# EAGLE schematic MURI_MEGA_DATALOGGER (EAGLE 9.1.1)
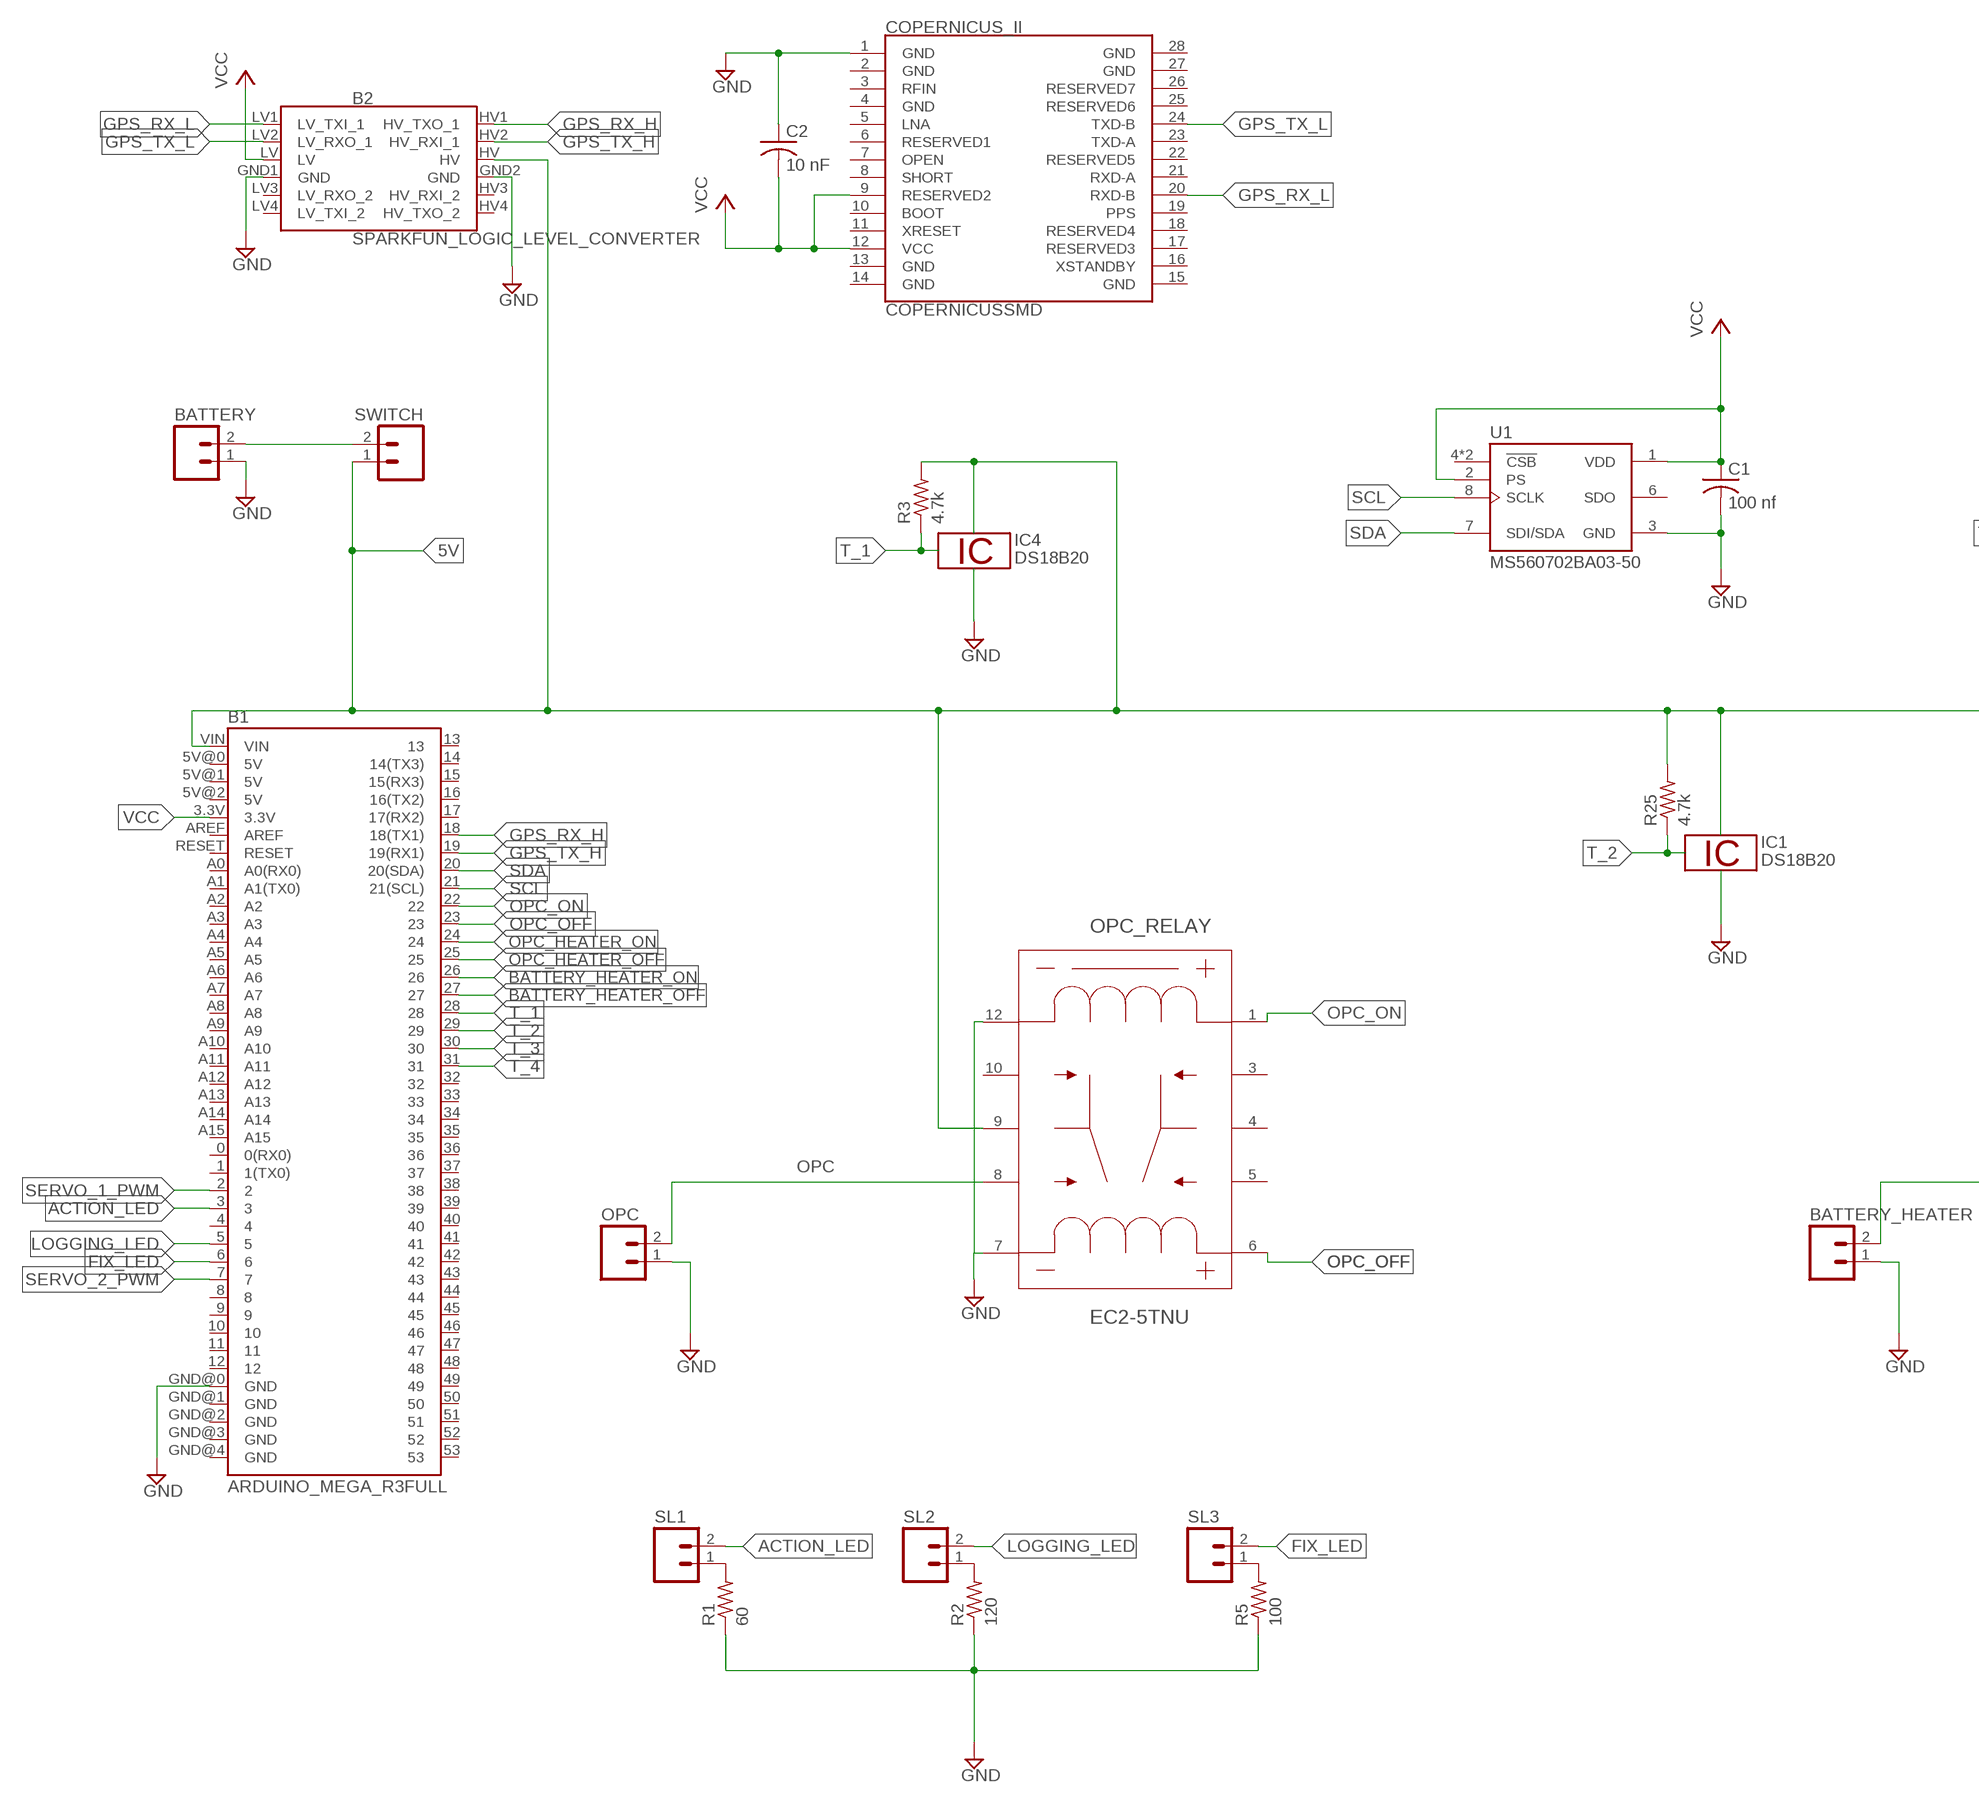
[diagram p0: schematic, sheet 1, part 1 of 2]
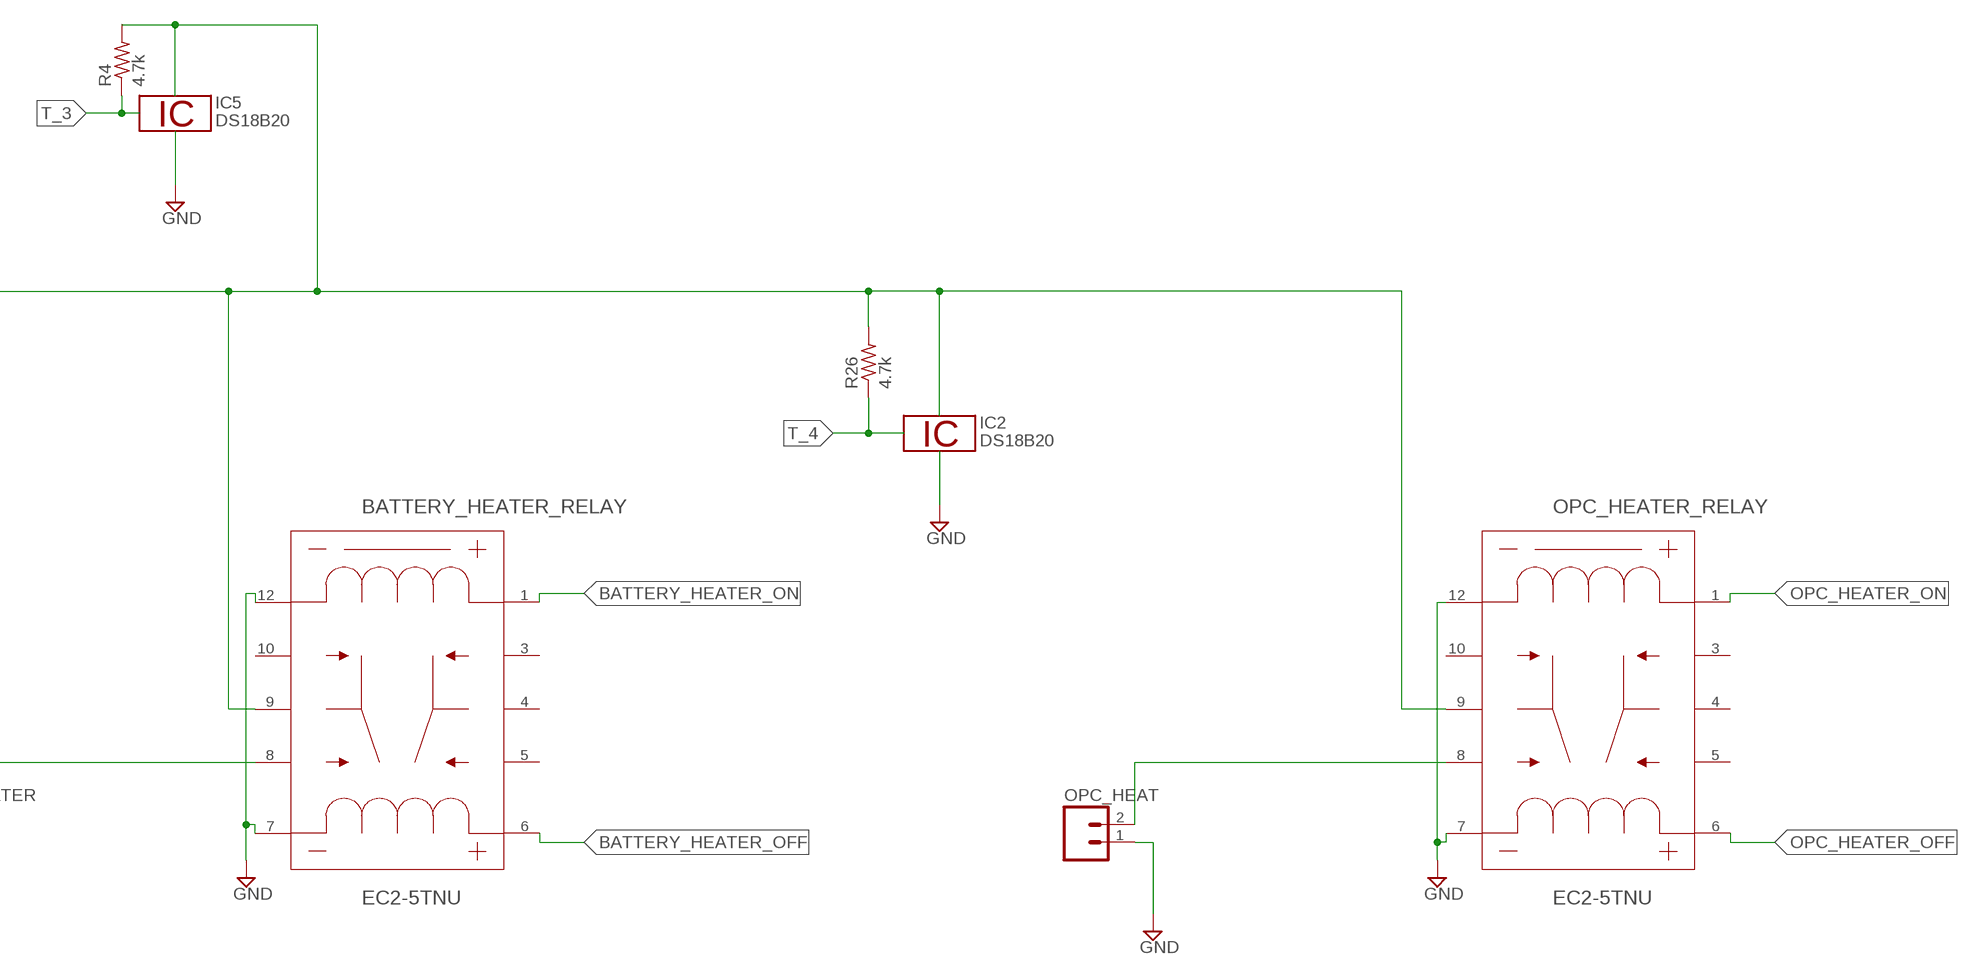
[diagram p1: schematic, sheet 1, part 2 of 2]

## Parts
B1  ARDUINO_MEGA_R3FULL  [ARDUINO_MEGA]
B2  SPARKFUN_LOGIC_LEVEL_CONVERTER  [SPARKFUN_LOGIC_LEVEL_CONVERTER]
BATTERY  M02  [02P]
BATTERY_HEATER  M02  [02P]
BATTERY_HEATER_RELAY  EC2-5TNU  [EC2TNU]
C1  100 nf  C-US025-025X050  [C025-025X050]
C2  10 nF  C-US025-025X050  [C025-025X050]
COPERNICUS_II  COPERNICUSSMD  [COPERNICUS]
IC1  DS18B20  [TO92-]
IC2  DS18B20  [TO92-]
IC4  DS18B20  [TO92-]
IC5  DS18B20  [TO92-]
OPC  M02  [02P]
OPC_HEAT  M02  [02P]
OPC_HEATER_RELAY  EC2-5TNU  [EC2TNU]
OPC_RELAY  EC2-5TNU  [EC2TNU]
R1  60  R-US_0204/7  [0204/7]
R2  120  R-US_0204/7  [0204/7]
R3  4.7k  R-US_0204/7  [0204/7]
R4  4.7k  R-US_0204/7  [0204/7]
R5  100  R-US_0204/7  [0204/7]
R25  4.7k  R-US_0204/7  [0204/7]
R26  4.7k  R-US_0204/7  [0204/7]
SL1  M02  [02P]
SL2  M02  [02P]
SL3  M02  [02P]
SWITCH  M02  [02P]
U1  MS560702BA03-50  [SON125P300X500X100-8N]

## Nets
5V [5V_Relay]: B1.VIN B2.HV BATTERY_HEATER_RELAY.9 OPC_HEATER_RELAY.9 OPC_RELAY.9 R3.2 R4.2 R25.2 R26.2 SWITCH.1
ACTION_LED: B1.3 SL1.2
BATTERY_HEATER [5V_Relay]: OPC_HEAT.2 OPC_HEATER_RELAY.8
BATTERY_HEATER_OFF: B1.27 BATTERY_HEATER_RELAY.6
BATTERY_HEATER_ON: B1.26 BATTERY_HEATER_RELAY.1
FIX_LED: B1.6 SL3.2
GND [5V_Relay]: B1.GND@0(GND) B2.GND1(GND) B2.GND2(GND) BATTERY.1 BATTERY_HEATER.1 BATTERY_HEATER_RELAY.7 BATTERY_HEATER_RELAY.12 C1.2 C2.1 COPERNICUS_II.1(GND) OPC.1 OPC_HEAT.1 OPC_HEATER_RELAY.7 OPC_HEATER_RELAY.12 OPC_RELAY.7 OPC_RELAY.12 R1.1 R2.1 R5.1 U1.3(GND)
GPS_RX_H: B1.18(18(TX1)) B2.HV1(HV_TXO_1)
GPS_RX_L: B2.LV1(LV_TXI_1) COPERNICUS_II.20(RXD-B)
GPS_TX_H: B1.19(19(RX1)) B2.HV2(HV_RXI_1)
GPS_TX_L: B2.LV2(LV_RXO_1) COPERNICUS_II.24(TXD-B)
LOGGING_LED: B1.5 SL2.2
N$1: BATTERY.2 SWITCH.2
N$2 [5V_Relay]: R5.2 SL3.1
N$3 [5V_Relay]: R1.2 SL1.1
N$4: R2.2 SL2.1
OPC [5V_Relay]: BATTERY_HEATER.2 BATTERY_HEATER_RELAY.8 OPC.2 OPC_RELAY.8
OPC_HEATER_OFF: B1.25 OPC_HEATER_RELAY.6
OPC_HEATER_ON: B1.24 OPC_HEATER_RELAY.1
OPC_OFF: B1.23 OPC_RELAY.6
OPC_ON: B1.22 OPC_RELAY.1
SCL: B1.21(21(SCL)) U1.8(SCLK)
SDA: B1.20(20(SDA)) U1.7(SDI/SDA)
SERVO_1_PWM: B1.2
SERVO_2_PWM: B1.7
T_1: B1.28 R3.1
T_2: B1.29 R25.1
T_3: B1.30 R4.1
T_4: B1.31 R26.1
VCC: B1.3.3V B2.LV C1.1 C2.2 COPERNICUS_II.9(RESERVED2) COPERNICUS_II.12(VCC) U1.1(VDD) U1.2(PS)
Unconnected: B1.0(0(RX0)) B1.1(1(TX0)) B1.4 B1.5V@0(5V) B1.5V@1(5V) B1.5V@2(5V) B1.8 B1.9 B1.10 B1.11 B1.12 B1.13 B1.14(14(TX3)) B1.15(15(RX3)) B1.16(16(TX2)) B1.17(17(RX2)) B1.32 B1.33 B1.34 B1.35 B1.36 B1.37 B1.38 B1.39 B1.40 B1.41 B1.42 B1.43 B1.44 B1.45 B1.46 B1.47 B1.48 B1.49 B1.50 B1.51 B1.52 B1.53 B1.A0(A0(RX0)) B1.A1(A1(TX0)) B1.A2 B1.A3 B1.A4 B1.A5 B1.A6 B1.A7 B1.A8 B1.A9 B1.A10 B1.A11 B1.A12 B1.A13 B1.A14 B1.A15 B1.AREF B1.GND@1(GND) B1.GND@2(GND) B1.GND@3(GND) B1.GND@4(GND) B1.RESET B2.HV3(HV_RXI_2) B2.HV4(HV_TXO_2) B2.LV3(LV_RXO_2) B2.LV4(LV_TXI_2) BATTERY_HEATER_RELAY.3 BATTERY_HEATER_RELAY.4 BATTERY_HEATER_RELAY.5 BATTERY_HEATER_RELAY.10 COPERNICUS_II.2(GND) COPERNICUS_II.3(RFIN) COPERNICUS_II.4(GND) COPERNICUS_II.5(LNA) COPERNICUS_II.6(RESERVED1) COPERNICUS_II.7(OPEN) COPERNICUS_II.8(SHORT) COPERNICUS_II.10(BOOT) COPERNICUS_II.11(XRESET) COPERNICUS_II.13(GND) COPERNICUS_II.14(GND) COPERNICUS_II.15(GND) COPERNICUS_II.16(XSTANDBY) COPERNICUS_II.17(RESERVED3) COPERNICUS_II.18(RESERVED4) COPERNICUS_II.19(PPS) COPERNICUS_II.21(RXD-A) COPERNICUS_II.22(RESERVED5) COPERNICUS_II.23(TXD-A) COPERNICUS_II.25(RESERVED6) COPERNICUS_II.26(RESERVED7) COPERNICUS_II.27(GND) COPERNICUS_II.28(GND) OPC_HEATER_RELAY.3 OPC_HEATER_RELAY.4 OPC_HEATER_RELAY.5 OPC_HEATER_RELAY.10 OPC_RELAY.3 OPC_RELAY.4 OPC_RELAY.5 OPC_RELAY.10 U1.4(!CSB) U1.5(!CSB) U1.6(SDO)

## Power pins joined to a net without a drawn wire
1W: IC1.2 IC2.2 IC4.2 IC5.2
GND: IC1.1 IC2.1 IC4.1 IC5.1
VDD: IC1.3 IC2.3 IC4.3 IC5.3

## Library data of the parts
B1 = SparkFun-Boards:ARDUINO_MEGA_R3: Arduino Mega R3 ATmega2560 R3 compatible footprint. SparkFun Products: Arduino Mega 2560 R3 <https://www.sparkfun.com/products/11061>
B2 = SparkFun-Boards:SPARKFUN_LOGIC_LEVEL_CONVERTER: SparkFun Logic Level Converter -Bi-Directional This is the mechnical outline for the 3.3V - 5V bi directional logic level converter. *Note, the "LOCK" Package has the header pins staggered by an offset of 5 mils (off center line), so that when you slide a row of standard 0.1" headers into the PTH pads, it will hold position vertically. See the follwing turorial for more information on this type of special footprints: Sneaky Footprints <https://www.sparkfun.com/tutorials/114> SparkFun Products: SparkFun Logic Level Converter - Bi-Directional <https://www.sparkfun.com/products/12009>
BATTERY BATTERY_HEATER OPC OPC_HEAT SL1-SL3 SWITCH = con-amp-quick:M02: AMP QUICK CONNECTOR; OC_FARNELL: unknown; OC_NEWARK: unknown
BATTERY_HEATER_RELAY OPC_HEATER_RELAY OPC_RELAY = EC2-5TNU:EC2-5TNU; MANUFACTURER_PART_NUMBER: EC25TNU; VENDOR: KEMET
C1 C2 = rcl:C-US: CAPACITOR, American symbol; SPICEPREFIX: C
COPERNICUS_II = SparkFun-GPS:COPERNICUS: Trimble Copernicus II GPS Receiver The Trimble Copernicus II delivers proven performance and Trimble quality for a new generation of position-enabled products. It features the TrimCore™ navigation software for extremely fast startup times and high performance in foliage canopy and urban canyon environments. SparkFun Products GPS Module - Copernicus II (12 Channel) <https://www.sparkfun.com/products/10922> (GPS-10922) SparkFun GPS Module - Copernicus II DIP (12 Channel) <https://www.sparkfun.com/products/11858> (GPS-11858); PROD_ID: GPS-10735; SF_ID: GPS-10922
IC1 IC2 IC4 IC5 = 1wire:DS18B20: Programmable Resolution Digital Thermometer This chip provides a onewire thermosensor with approx. 0.5°C accuracy. A programmable over/undertemperure alarm is available. The precision can be set from 9..12 bits. Notes: Vdd must be applied for accurate measurements at low temperatures, as the parasite power circuit otherwise heats the sensor. If parasite power is used, Vdd has to be connected to GND. The DS1822 is a low-cost thermometer chip, the DS18S20 is similar to the DS18B20, but with 9 Bit precision only. Author: Jan Kandziora <jjj@gmx.de>
R1-R5 R25 R26 = resistor:R-US_: RESISTOR, American symbol
U1 = MS560702BA03-50:MS560702BA03-50: BAROMETRIC PRESSURE SENSOR; COMMENT: MS560702BA03-50; DESCRIPTION: MS5607-02BA03 Series 3 V 1 to 120 kPa Absolute Barometric Pressure Sensor; DIGI-KEY_PART_NUMBER: 223-1198-1-ND; DIGI-KEY_PURCHASE_URL: https://www.digikey.com/product-detail/en/te-connectivity-measurement-specialties/MS560702BA03-50/223-1198-1-ND/4700921?utm_source=snapeda&utm_medium=aggregator&utm_campaign=symbol; EU_ROHS_COMPLIANCE: Compliant; MF: TE Connectivity; MP: MS560702BA03-50; PACKAGE: SMD-8 TE Connectivity; TE_PURCHASE_URL: https://www.te.com/usa-en/product-MS560702BA03-50.html?te_bu=Cor&te_type=disp&te_campaign=seda_glo_cor-seda-global-disp-prtnr-fy19-seda-model-bom-cta_sma-317_1&elqCampaignId=32493

## Net classes
1 5V_Relay: width 0.254 mm, drill 0.889 mm, clearance 0.127 mm